# EAGLE schematic sanguish (EAGLE 6.2)
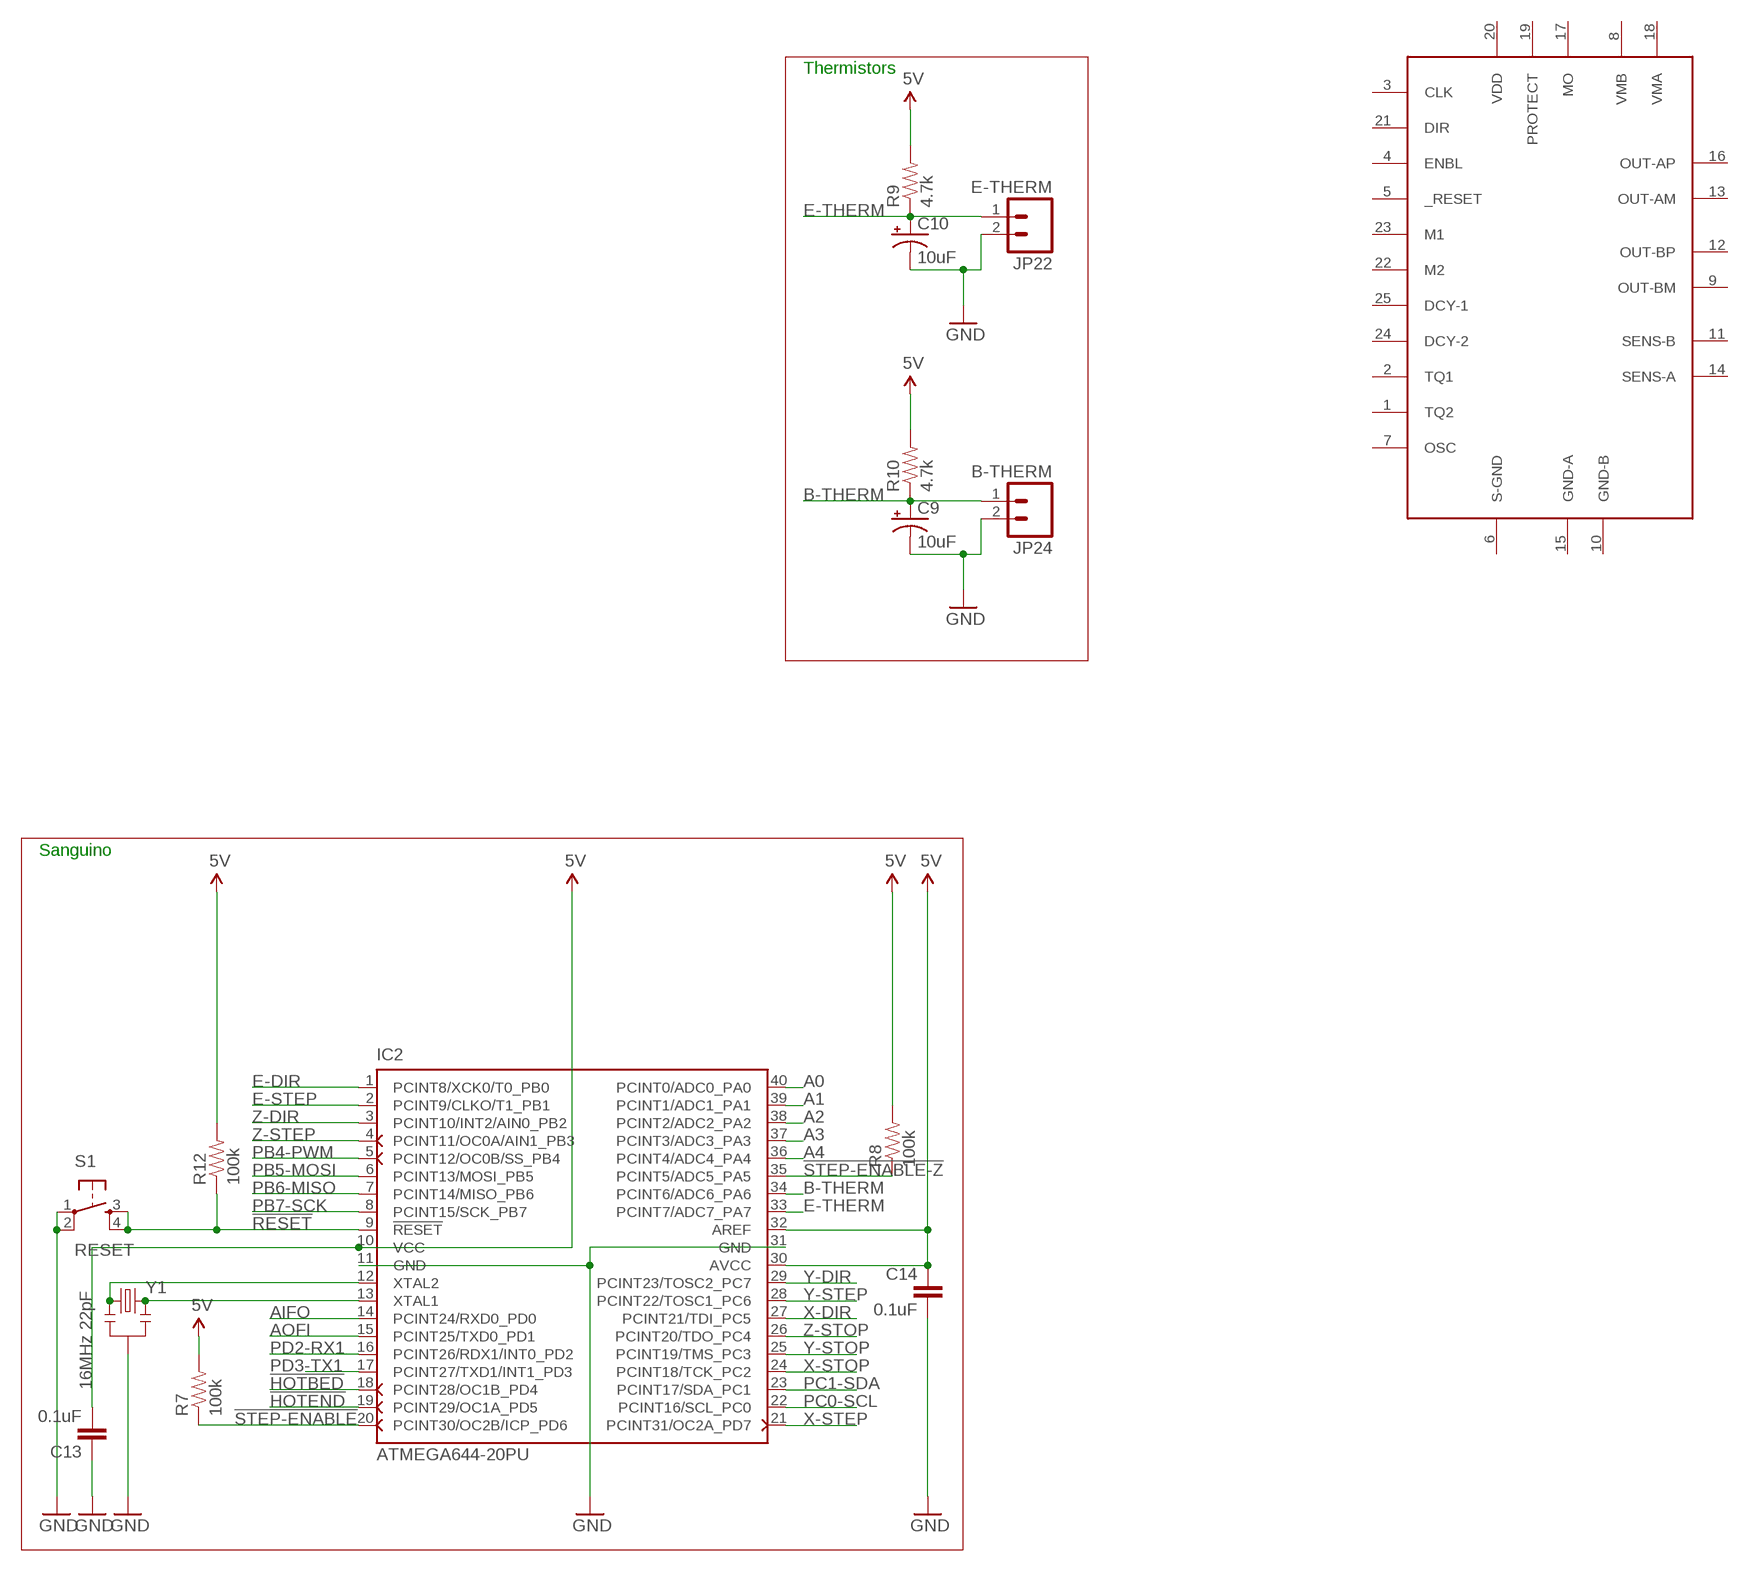
[diagram p0: schematic, sheet 1]

## Parts
C9  10uF  CAP_POLPTH2  [CPOL-RADIAL-10UF-25V]
C10  10uF  CAP_POLPTH2  [CPOL-RADIAL-10UF-25V]
C13  0.1uF  CAPPTH2  [CAP-PTH-SMALL2]
C14  0.1uF  CAPPTH2  [CAP-PTH-SMALL2]
IC2  ATMEGA644-20PU  [DIL40]
JP22  E-THERM  M02PTH  [1X02]
JP24  B-THERM  M02PTH  [1X02]
R7  100k  RESISTORPTH1  [AXIAL-0.3]
R8  100k  RESISTORPTH1  [AXIAL-0.3]
R9  4.7k  RESISTORPTH1  [AXIAL-0.3]
R10  4.7k  RESISTORPTH1  [AXIAL-0.3]
R12  100k  RESISTORPTH1  [AXIAL-0.3]
S1  RESET  TAC_SWITCHPTH  [TACTILE-PTH]
U$1  TB6560  [ZIP25]
Y1  16MHz 22pF  RESONATORPTH  [RESONATOR-PTH]

## Nets
5V: C13.2 C14.1 IC2.10(VCC) IC2.30(AVCC) IC2.32(AREF) R7.P$2 R8.P$2 R9.P$2 R10.P$2 R12.P$2
!HOTBED: IC2.18(PCINT28/OC1B_PD4)
!HOTEND: IC2.19(PCINT29/OC1A_PD5)
!RESET: IC2.9(!RESET) R12.P$1 S1.3 S1.4
!STEP-ENABLE: IC2.20(PCINT30/OC2B/ICP_PD6) R7.P$1
!STEP-ENABLE-Z: IC2.35(PCINT5/ADC5_PA5) R8.P$1
A0: IC2.40(PCINT0/ADC0_PA0)
A1: IC2.39(PCINT1/ADC1_PA1)
A2: IC2.38(PCINT2/ADC2_PA2)
A3: IC2.37(PCINT3/ADC3_PA3)
A4: IC2.36(PCINT4/ADC4_PA4)
AIFO: IC2.14(PCINT24/RXD0_PD0)
AOFI: IC2.15(PCINT25/TXD0_PD1)
B-THERM: C9.1(+) IC2.34(PCINT6/ADC6_PA6) JP24.1 R10.P$1
E-DIR: IC2.1(PCINT8/XCK0/T0_PB0)
E-STEP: IC2.2(PCINT9/CLKO/T1_PB1)
E-THERM: C10.1(+) IC2.33(PCINT7/ADC7_PA7) JP22.1 R9.P$1
GND [power]: C9.2(-) C10.2(-) C13.1 C14.2 IC2.11(GND) IC2.31(GND) JP22.2 JP24.2 S1.1 S1.2 Y1.2
PB4-PWM: IC2.5(PCINT12/OC0B/SS_PB4)
PB5-MOSI: IC2.6(PCINT13/MOSI_PB5)
PB6-MISO: IC2.7(PCINT14/MISO_PB6)
PB7-SCK: IC2.8(PCINT15/SCK_PB7)
PC0-SCL: IC2.22(PCINT16/SCL_PC0)
PC1-SDA: IC2.23(PCINT17/SDA_PC1)
PD2-RX1: IC2.16(PCINT26/RDX1/INT0_PD2)
PD3-TX1: IC2.17(PCINT27/TXD1/INT1_PD3)
X-DIR: IC2.27(PCINT21/TDI_PC5)
X-STEP: IC2.21(PCINT31/OC2A_PD7)
X-STOP: IC2.24(PCINT18/TCK_PC2)
XTAL1: IC2.13(XTAL1) Y1.3
XTAL2: IC2.12(XTAL2) Y1.1
Y-DIR: IC2.29(PCINT23/TOSC2_PC7)
Y-STEP: IC2.28(PCINT22/TOSC1_PC6)
Y-STOP: IC2.25(PCINT19/TMS_PC3)
Z-DIR: IC2.3(PCINT10/INT2/AIN0_PB2)
Z-STEP: IC2.4(PCINT11/OC0A/AIN1_PB3)
Z-STOP: IC2.26(PCINT20/TDO_PC4)
Unconnected: U$1.1(TQ2) U$1.2(TQ1) U$1.3(CLK) U$1.4(ENBL) U$1.5(_RESET) U$1.6(S-GND) U$1.7(OSC) U$1.8(VMB) U$1.9(OUT-BM) U$1.10(GND-B) U$1.11(SENS-B) U$1.12(OUT-BP) U$1.13(OUT-AM) U$1.14(SENS-A) U$1.15(GND-A) U$1.16(OUT-AP) U$1.17(MO) U$1.18(VMA) U$1.19(PROTECT) U$1.20(VDD) U$1.21(DIR) U$1.22(M2) U$1.23(M1) U$1.24(DCY-2) U$1.25(DCY-1)

## Notes on the sheet
- Thermistors
- Sanguino

## Library data of the parts
C9 C10 = SparkFun:CAP_POL: Capacitor Polarized These are standard SMD and PTH capacitors. Normally 10uF, 47uF, and 100uF in electrolytic and tantalum varieties. Always verify the external diameter of the through hole cap, it varies with capacity, voltage, and manufacturer. The EIA devices should be standard.
C13 C14 = SparkFun:CAP: Capacitor Standard 0603 ceramic capacitor, and 0.1" leaded capacitor.
IC2 = atmel:ATMEGA644-*PU: 8-bit Microcontroller with 64K Bytes In-System Programmable Flash Auto generated by make-symbol-device-package-bsdl.ulp Rev. 34 Source: http://www.atmel.com/dyn/resources/prod_documents/doc2593.pdf; MPN: ATMEGA644-20PU; OC_FARNELL: 1288340; OC_NEWARK: 23M5060
JP22 JP24 = SparkFun:M02: Header 2 Standard 2-pin 0.1" header. Use with straight break away headers (SKU : PRT-00116), right angle break away headers (PRT-00553), swiss pins (PRT-00743), machine pins (PRT-00117), and female headers (PRT-00115). Molex polarized connector foot print use with SKU : PRT-08233 with associated crimp pins and housings.
R7-R10 R12 = SparkFun:RESISTOR: Resistor Basic schematic elements and footprints for 0603, 1206, and PTH 1/10th watt (small) resistors.
S1 = SparkFun:TAC_SWITCH: Momentary Switch Button commonly used for reset or general input. Spark Fun Electronics SKU : COM-00097
U$1 = tb6560:TB6560
Y1 = SparkFun:RESONATOR: Resonator Small SMD resonator. This is the itty bitty 10/20MHz resonators with built in caps. CSTCE10M0G55 and CSTCE20M0V53. Footprint has been reviewed closely but hasn't been tested yet.